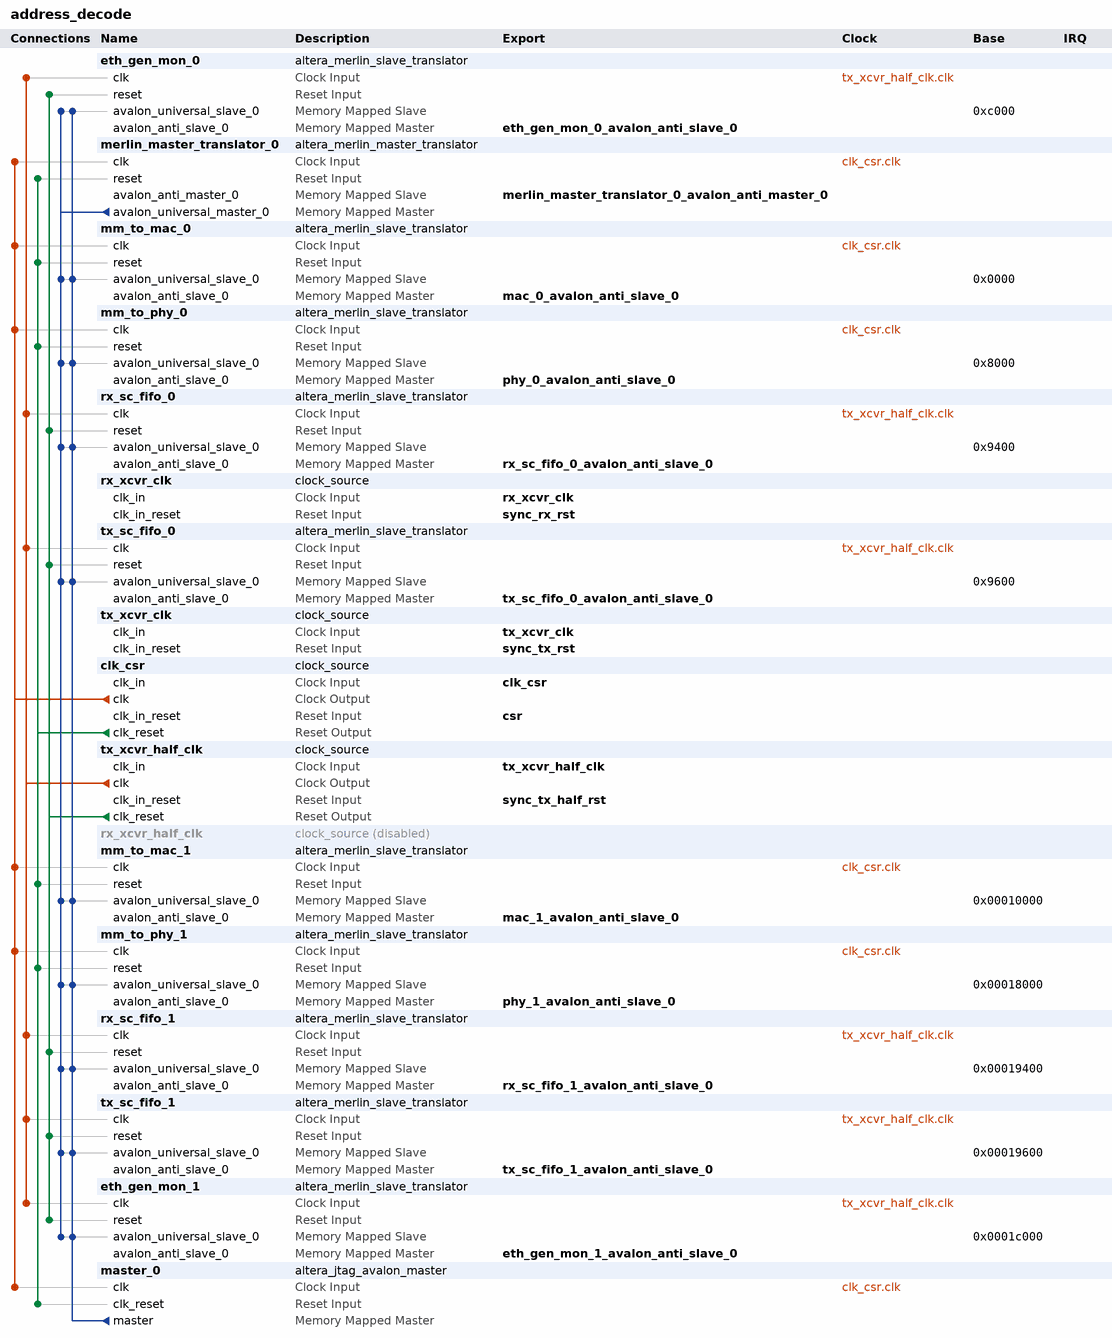
[diagram p0: system contents]
# Platform Designer (Qsys) system address_decode, Stratix 10 ND5_40_PART1
# Parameters at their usual value, and those the tool derives, are not listed.
package require -exact qsys 1.0
create_system address_decode
set_project_property DEVICE_FAMILY {Stratix 10}
set_project_property DEVICE ND5_40_PART1

add_component eth_gen_mon_0 ip/address_decode/address_decode_eth_gen_mon.ip altera_merlin_slave_translator eth_gen_mon_0 16.1

add_component merlin_master_translator_0 ip/address_decode/address_decode_merlin_master_translator_0.ip altera_merlin_master_translator merlin_master_translator_0 16.1

add_component mm_to_mac_0 ip/address_decode/address_decode_mm_to_mac.ip altera_merlin_slave_translator mm_to_mac_0 16.1

add_component mm_to_phy_0 ip/address_decode/address_decode_mm_to_phy.ip altera_merlin_slave_translator mm_to_phy_0 16.1

add_component rx_sc_fifo_0 ip/address_decode/address_decode_rx_sc_fifo.ip altera_merlin_slave_translator rx_sc_fifo_0 16.1

add_component rx_xcvr_clk ip/address_decode/address_decode_rx_xcvr_clk.ip clock_source rx_xcvr_clk 

add_component tx_sc_fifo_0 ip/address_decode/address_decode_tx_sc_fifo.ip altera_merlin_slave_translator tx_sc_fifo_0 16.1

add_component tx_xcvr_clk ip/address_decode/address_decode_tx_xcvr_clk.ip clock_source tx_xcvr_clk 

add_component clk_csr ip/address_decode/address_decode_clk_csr.ip clock_source clk_csr 

add_component tx_xcvr_half_clk ip/address_decode/address_decode_tx_xcvr_half_clk.ip clock_source tx_xcvr_half_clk 

add_instance rx_xcvr_half_clk clock_source 16.1
set_instance_property rx_xcvr_half_clk ENABLED false
set_instance_parameter_value rx_xcvr_half_clk clockFrequency 161132800

add_component mm_to_mac_1 ip/address_decode/address_decode_mm_to_mac.ip altera_merlin_slave_translator mm_to_mac_1 16.1

add_component mm_to_phy_1 ip/address_decode/address_decode_mm_to_phy.ip altera_merlin_slave_translator mm_to_phy_1 16.1

add_component rx_sc_fifo_1 ip/address_decode/address_decode_rx_sc_fifo.ip altera_merlin_slave_translator rx_sc_fifo_1 16.1

add_component tx_sc_fifo_1 ip/address_decode/address_decode_tx_sc_fifo.ip altera_merlin_slave_translator tx_sc_fifo_1 16.1

add_component eth_gen_mon_1 ip/address_decode/address_decode_eth_gen_mon.ip altera_merlin_slave_translator eth_gen_mon_1 16.1

add_component master_0 ip/address_decode/address_decode_master_0.ip altera_jtag_avalon_master master_0 16.1

# connections
add_connection clk_csr.clk master_0.clk clock
add_connection clk_csr.clk merlin_master_translator_0.clk clock
add_connection clk_csr.clk mm_to_mac_0.clk clock
add_connection clk_csr.clk mm_to_mac_1.clk clock
add_connection clk_csr.clk mm_to_phy_0.clk clock
add_connection clk_csr.clk mm_to_phy_1.clk clock
add_connection tx_xcvr_half_clk.clk eth_gen_mon_0.clk clock
add_connection tx_xcvr_half_clk.clk eth_gen_mon_1.clk clock
add_connection tx_xcvr_half_clk.clk rx_sc_fifo_0.clk clock
add_connection tx_xcvr_half_clk.clk rx_sc_fifo_1.clk clock
add_connection tx_xcvr_half_clk.clk tx_sc_fifo_0.clk clock
add_connection tx_xcvr_half_clk.clk tx_sc_fifo_1.clk clock
add_connection clk_csr.clk_reset master_0.clk_reset reset
add_connection clk_csr.clk_reset merlin_master_translator_0.reset reset
add_connection clk_csr.clk_reset mm_to_mac_0.reset reset
add_connection clk_csr.clk_reset mm_to_mac_1.reset reset
add_connection clk_csr.clk_reset mm_to_phy_0.reset reset
add_connection clk_csr.clk_reset mm_to_phy_1.reset reset
add_connection tx_xcvr_half_clk.clk_reset eth_gen_mon_0.reset reset
add_connection tx_xcvr_half_clk.clk_reset eth_gen_mon_1.reset reset
add_connection tx_xcvr_half_clk.clk_reset rx_sc_fifo_0.reset reset
add_connection tx_xcvr_half_clk.clk_reset rx_sc_fifo_1.reset reset
add_connection tx_xcvr_half_clk.clk_reset tx_sc_fifo_0.reset reset
add_connection tx_xcvr_half_clk.clk_reset tx_sc_fifo_1.reset reset
add_connection master_0.master eth_gen_mon_0.avalon_universal_slave_0 avalon
set_connection_parameter_value master_0.master/eth_gen_mon_0.avalon_universal_slave_0 baseAddress 0xc000
add_connection master_0.master eth_gen_mon_1.avalon_universal_slave_0 avalon
set_connection_parameter_value master_0.master/eth_gen_mon_1.avalon_universal_slave_0 baseAddress 0x0001c000
add_connection master_0.master mm_to_mac_0.avalon_universal_slave_0 avalon
set_connection_parameter_value master_0.master/mm_to_mac_0.avalon_universal_slave_0 baseAddress 0x0000
add_connection master_0.master mm_to_mac_1.avalon_universal_slave_0 avalon
set_connection_parameter_value master_0.master/mm_to_mac_1.avalon_universal_slave_0 baseAddress 0x00010000
add_connection master_0.master mm_to_phy_0.avalon_universal_slave_0 avalon
set_connection_parameter_value master_0.master/mm_to_phy_0.avalon_universal_slave_0 baseAddress 0x8000
add_connection master_0.master mm_to_phy_1.avalon_universal_slave_0 avalon
set_connection_parameter_value master_0.master/mm_to_phy_1.avalon_universal_slave_0 baseAddress 0x00018000
add_connection master_0.master rx_sc_fifo_0.avalon_universal_slave_0 avalon
set_connection_parameter_value master_0.master/rx_sc_fifo_0.avalon_universal_slave_0 baseAddress 0x9400
add_connection master_0.master rx_sc_fifo_1.avalon_universal_slave_0 avalon
set_connection_parameter_value master_0.master/rx_sc_fifo_1.avalon_universal_slave_0 baseAddress 0x00019400
add_connection master_0.master tx_sc_fifo_0.avalon_universal_slave_0 avalon
set_connection_parameter_value master_0.master/tx_sc_fifo_0.avalon_universal_slave_0 baseAddress 0x9600
add_connection master_0.master tx_sc_fifo_1.avalon_universal_slave_0 avalon
set_connection_parameter_value master_0.master/tx_sc_fifo_1.avalon_universal_slave_0 baseAddress 0x00019600
add_connection merlin_master_translator_0.avalon_universal_master_0 eth_gen_mon_0.avalon_universal_slave_0 avalon
set_connection_parameter_value merlin_master_translator_0.avalon_universal_master_0/eth_gen_mon_0.avalon_universal_slave_0 baseAddress 0xc000
add_connection merlin_master_translator_0.avalon_universal_master_0 eth_gen_mon_1.avalon_universal_slave_0 avalon
set_connection_parameter_value merlin_master_translator_0.avalon_universal_master_0/eth_gen_mon_1.avalon_universal_slave_0 baseAddress 0x0001c000
add_connection merlin_master_translator_0.avalon_universal_master_0 mm_to_mac_0.avalon_universal_slave_0 avalon
set_connection_parameter_value merlin_master_translator_0.avalon_universal_master_0/mm_to_mac_0.avalon_universal_slave_0 baseAddress 0x0000
add_connection merlin_master_translator_0.avalon_universal_master_0 mm_to_mac_1.avalon_universal_slave_0 avalon
set_connection_parameter_value merlin_master_translator_0.avalon_universal_master_0/mm_to_mac_1.avalon_universal_slave_0 baseAddress 0x00010000
add_connection merlin_master_translator_0.avalon_universal_master_0 mm_to_phy_0.avalon_universal_slave_0 avalon
set_connection_parameter_value merlin_master_translator_0.avalon_universal_master_0/mm_to_phy_0.avalon_universal_slave_0 baseAddress 0x8000
add_connection merlin_master_translator_0.avalon_universal_master_0 mm_to_phy_1.avalon_universal_slave_0 avalon
set_connection_parameter_value merlin_master_translator_0.avalon_universal_master_0/mm_to_phy_1.avalon_universal_slave_0 baseAddress 0x00018000
add_connection merlin_master_translator_0.avalon_universal_master_0 rx_sc_fifo_0.avalon_universal_slave_0 avalon
set_connection_parameter_value merlin_master_translator_0.avalon_universal_master_0/rx_sc_fifo_0.avalon_universal_slave_0 baseAddress 0x9400
add_connection merlin_master_translator_0.avalon_universal_master_0 rx_sc_fifo_1.avalon_universal_slave_0 avalon
set_connection_parameter_value merlin_master_translator_0.avalon_universal_master_0/rx_sc_fifo_1.avalon_universal_slave_0 baseAddress 0x00019400
add_connection merlin_master_translator_0.avalon_universal_master_0 tx_sc_fifo_0.avalon_universal_slave_0 avalon
set_connection_parameter_value merlin_master_translator_0.avalon_universal_master_0/tx_sc_fifo_0.avalon_universal_slave_0 baseAddress 0x9600
add_connection merlin_master_translator_0.avalon_universal_master_0 tx_sc_fifo_1.avalon_universal_slave_0 avalon
set_connection_parameter_value merlin_master_translator_0.avalon_universal_master_0/tx_sc_fifo_1.avalon_universal_slave_0 baseAddress 0x00019600

# exported interfaces
add_interface clk_csr clock sink
set_interface_property clk_csr EXPORT_OF clk_csr.clk_in
add_interface csr reset sink
set_interface_property csr EXPORT_OF clk_csr.clk_in_reset
add_interface eth_gen_mon_0_avalon_anti_slave_0 avalon master
set_interface_property eth_gen_mon_0_avalon_anti_slave_0 EXPORT_OF eth_gen_mon_0.avalon_anti_slave_0
add_interface eth_gen_mon_1_avalon_anti_slave_0 avalon master
set_interface_property eth_gen_mon_1_avalon_anti_slave_0 EXPORT_OF eth_gen_mon_1.avalon_anti_slave_0
add_interface mac_0_avalon_anti_slave_0 avalon master
set_interface_property mac_0_avalon_anti_slave_0 EXPORT_OF mm_to_mac_0.avalon_anti_slave_0
add_interface mac_1_avalon_anti_slave_0 avalon master
set_interface_property mac_1_avalon_anti_slave_0 EXPORT_OF mm_to_mac_1.avalon_anti_slave_0
add_interface merlin_master_translator_0_avalon_anti_master_0 avalon slave
set_interface_property merlin_master_translator_0_avalon_anti_master_0 EXPORT_OF merlin_master_translator_0.avalon_anti_master_0
add_interface phy_0_avalon_anti_slave_0 avalon master
set_interface_property phy_0_avalon_anti_slave_0 EXPORT_OF mm_to_phy_0.avalon_anti_slave_0
add_interface phy_1_avalon_anti_slave_0 avalon master
set_interface_property phy_1_avalon_anti_slave_0 EXPORT_OF mm_to_phy_1.avalon_anti_slave_0
add_interface rx_sc_fifo_0_avalon_anti_slave_0 avalon master
set_interface_property rx_sc_fifo_0_avalon_anti_slave_0 EXPORT_OF rx_sc_fifo_0.avalon_anti_slave_0
add_interface rx_sc_fifo_1_avalon_anti_slave_0 avalon master
set_interface_property rx_sc_fifo_1_avalon_anti_slave_0 EXPORT_OF rx_sc_fifo_1.avalon_anti_slave_0
add_interface rx_xcvr_clk clock sink
set_interface_property rx_xcvr_clk EXPORT_OF rx_xcvr_clk.clk_in
add_interface sync_rx_rst reset sink
set_interface_property sync_rx_rst EXPORT_OF rx_xcvr_clk.clk_in_reset
add_interface sync_tx_half_rst reset sink
set_interface_property sync_tx_half_rst EXPORT_OF tx_xcvr_half_clk.clk_in_reset
add_interface sync_tx_rst reset sink
set_interface_property sync_tx_rst EXPORT_OF tx_xcvr_clk.clk_in_reset
add_interface tx_sc_fifo_0_avalon_anti_slave_0 avalon master
set_interface_property tx_sc_fifo_0_avalon_anti_slave_0 EXPORT_OF tx_sc_fifo_0.avalon_anti_slave_0
add_interface tx_sc_fifo_1_avalon_anti_slave_0 avalon master
set_interface_property tx_sc_fifo_1_avalon_anti_slave_0 EXPORT_OF tx_sc_fifo_1.avalon_anti_slave_0
add_interface tx_xcvr_clk clock sink
set_interface_property tx_xcvr_clk EXPORT_OF tx_xcvr_clk.clk_in
add_interface tx_xcvr_half_clk clock sink
set_interface_property tx_xcvr_half_clk EXPORT_OF tx_xcvr_half_clk.clk_in

set_interconnect_requirement {$system} qsys_mm.clockCrossingAdapter HANDSHAKE
set_interconnect_requirement {$system} qsys_mm.insertDefaultSlave FALSE
set_interconnect_requirement {$system} qsys_mm.maxAdditionalLatency 1

save_system address_decode.qsys
